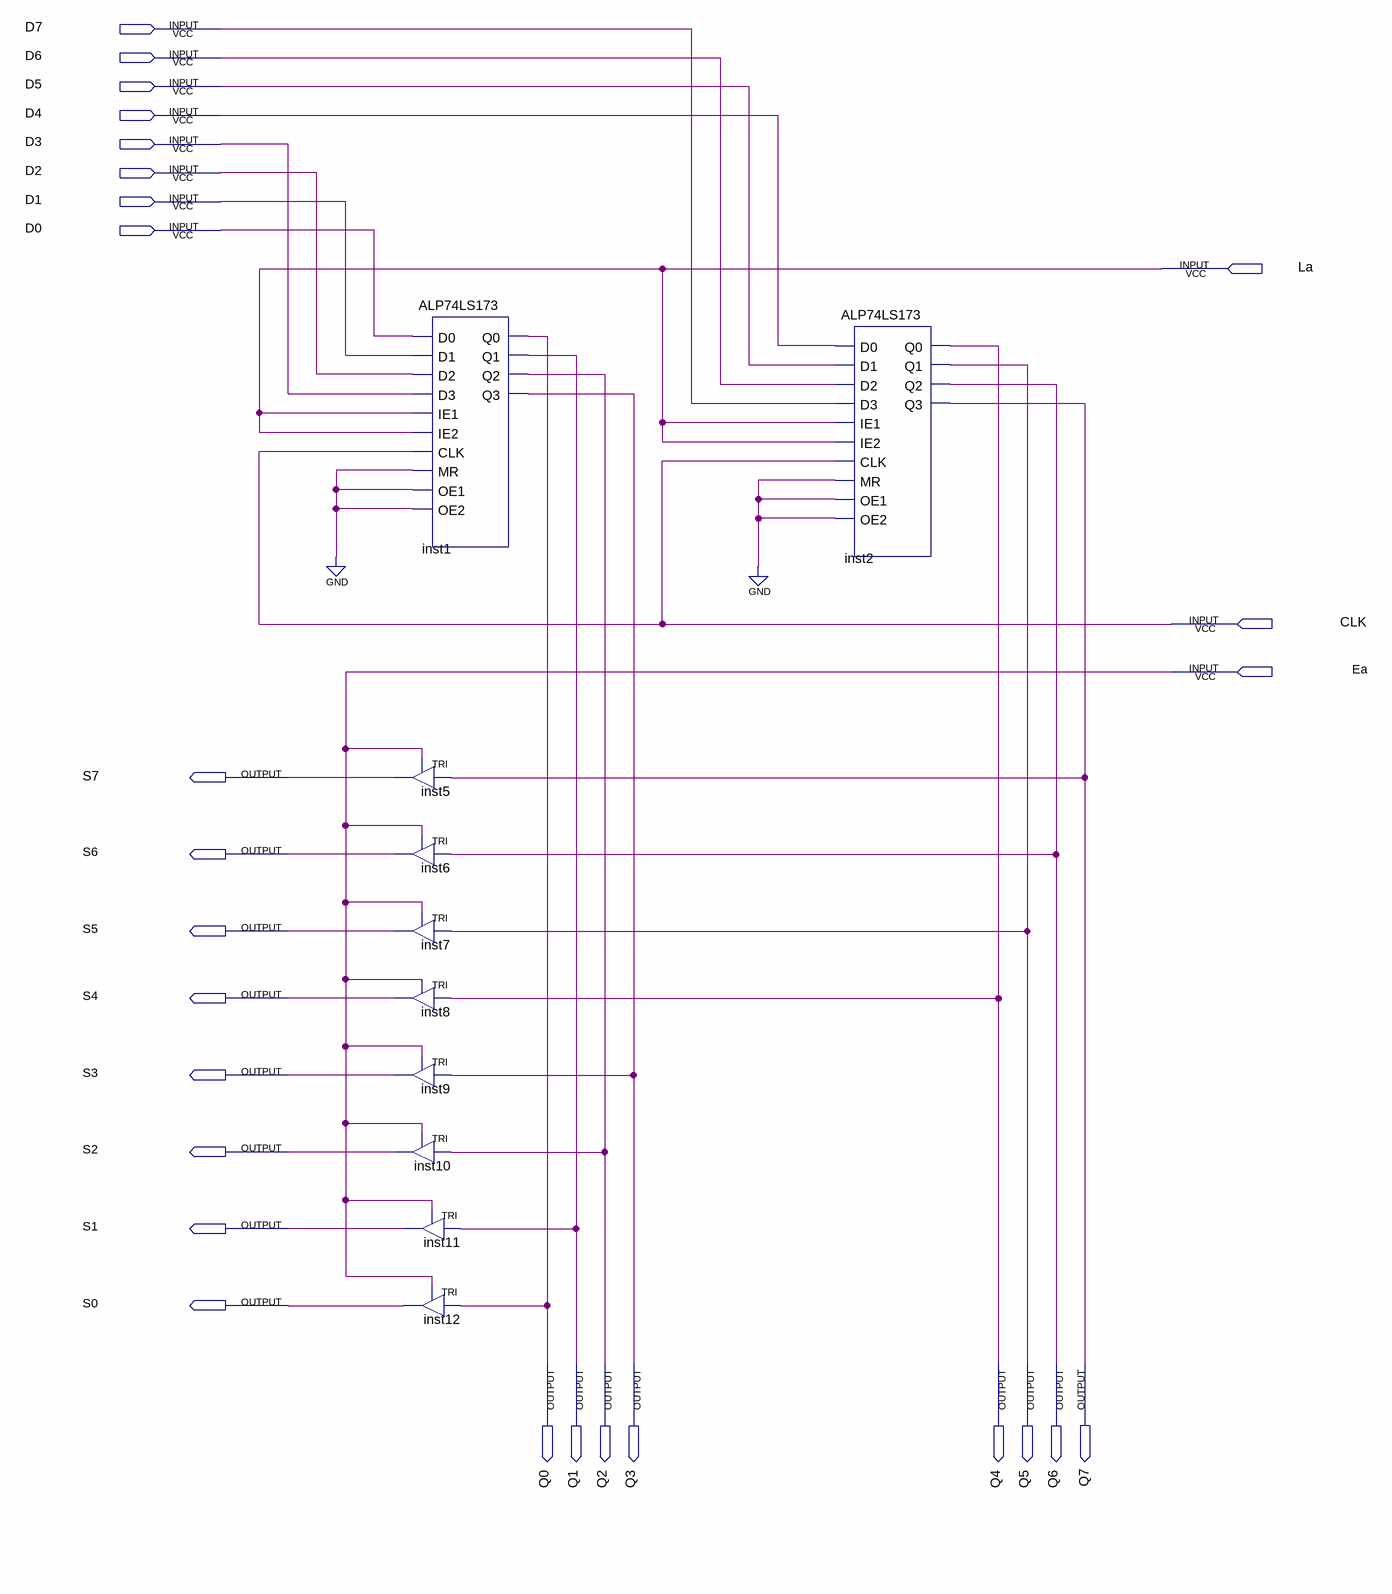
[diagram p0: schematic sheet]
// Quartus schematic acumulador.bdf as structural Verilog: 10 symbols, 27 pins
module acumulador (
  input  D7,
  input  D6,
  input  D5,
  input  D4,
  input  D3,
  input  D2,
  input  D1,
  input  D0,
  input  La,
  input  CLK,
  input  Ea,
  output S7,
  output S6,
  output S5,
  output S4,
  output S3,
  output S2,
  output S1,
  output S0,
  output Q0,
  output Q1,
  output Q2,
  output Q3,
  output Q4,
  output Q5,
  output Q6,
  output Q7
);

  TRI inst5 (.IN(Q7), .OE(Ea), .OUT(S7));
  TRI inst6 (.IN(Q6), .OE(Ea), .OUT(S6));
  TRI inst7 (.IN(Q5), .OE(Ea), .OUT(S5));
  TRI inst8 (.IN(Q4), .OE(Ea), .OUT(S4));
  TRI inst9 (.IN(Q3), .OE(Ea), .OUT(S3));
  TRI inst10 (.IN(Q2), .OE(Ea), .OUT(S2));
  ALP74LS173 inst1 (
    .D0(D0), .D1(D1), .D2(D2), .D3(D3), .IE1(La), .IE2(La), .MR(1'b0), .OE1(1'b0), .OE2(1'b0), .CP(CLK),
    .Q0(Q0), .Q1(Q1), .Q2(Q2), .Q3(Q3));
  TRI inst11 (.IN(Q1), .OE(Ea), .OUT(S1));
  TRI inst12 (.IN(Q0), .OE(Ea), .OUT(S0));
  ALP74LS173 inst2 (
    .D0(D4), .D1(D5), .D2(D6), .D3(D7), .IE1(La), .IE2(La), .MR(1'b0), .OE1(1'b0), .OE2(1'b0), .CP(CLK),
    .Q0(Q4), .Q1(Q5), .Q2(Q6), .Q3(Q7));
endmodule
